# EAGLE schematic main (EAGLE 7.3.0)
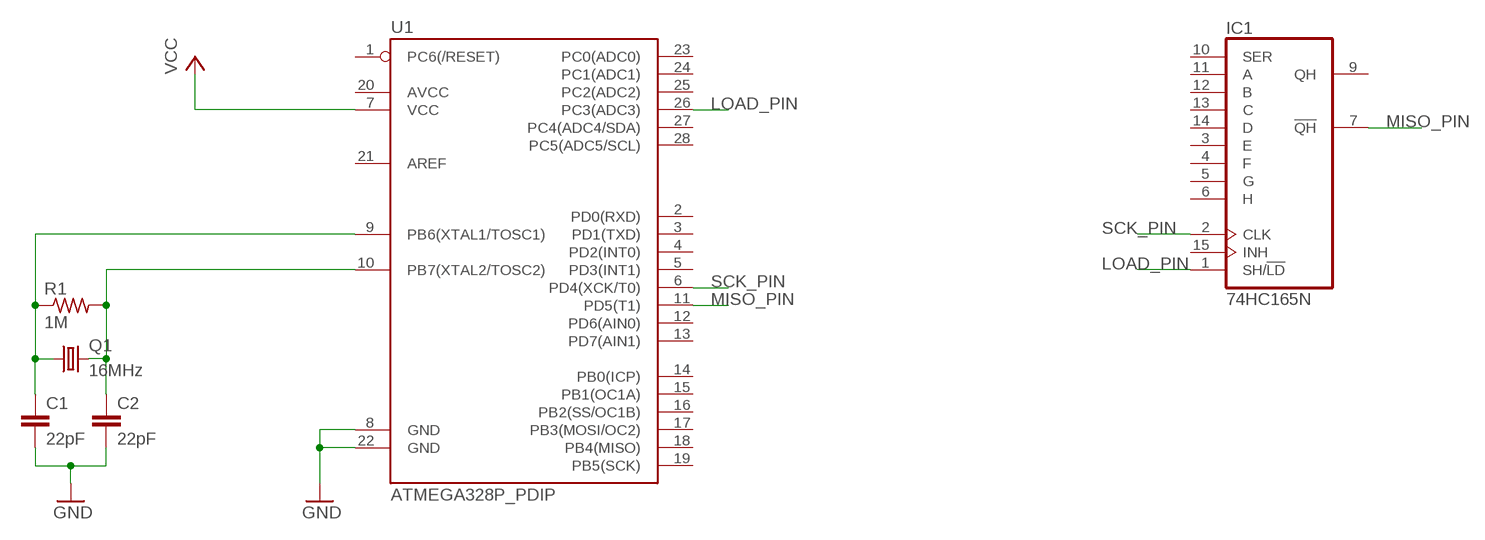
[diagram p0: schematic, sheet 1]

## Parts
C1  22pF  CAPPTH3  [CAP-PTH-LARGE]
C2  22pF  CAPPTH1  [CAP-PTH-5MM]
IC1  74HC165N  [DIL16]
Q1  16MHz  CRYSTALHC33U-V  [HC33U-V]
R1  1M  R-US_0207/10  [0207/10]
U1  ATMEGA328P_PDIP  [DIL28-3]

## Nets
GND: C1.2 C2.2 U1.8(GND) U1.22(GND)
LOAD_PIN: IC1.1(SH/!LD) U1.26(PC3(ADC3))
MISO_PIN: IC1.7(!QH) U1.11(PD5(T1))
N$1: C1.1 Q1.1 R1.1 U1.9(PB6(XTAL1/TOSC1))
N$2: C2.1 Q1.2 R1.2 U1.10(PB7(XTAL2/TOSC2))
SCK_PIN: IC1.2(CLK) U1.6(PD4(XCK/T0))
VCC: U1.7(VCC)
Unconnected: IC1.3(E) IC1.4(F) IC1.5(G) IC1.6(H) IC1.9(QH) IC1.10(SER) IC1.11(A) IC1.12(B) IC1.13(C) IC1.14(D) IC1.15(INH) U1.1(PC6(/RESET)) U1.2(PD0(RXD)) U1.3(PD1(TXD)) U1.4(PD2(INT0)) U1.5(PD3(INT1)) U1.12(PD6(AIN0)) U1.13(PD7(AIN1)) U1.14(PB0(ICP)) U1.15(PB1(OC1A)) U1.16(PB2(SS/OC1B)) U1.17(PB3(MOSI/OC2)) U1.18(PB4(MISO)) U1.19(PB5(SCK)) U1.20(AVCC) U1.21(AREF) U1.23(PC0(ADC0)) U1.24(PC1(ADC1)) U1.25(PC2(ADC2)) U1.27(PC4(ADC4/SDA)) U1.28(PC5(ADC5/SCL))

## Power pins joined to a net without a drawn wire
GND: IC1.8(GND)
VCC: IC1.16(VCC)

## Library data of the parts
C1 C2 = SparkFun-Passives:CAP: Capacitor Standard 0603 ceramic capacitor, and 0.1" leaded capacitor.
IC1 = 74xx-eu:74*165: 8-bit parallel load SHIFT REGISTER
Q1 = crystal:CRYSTAL: CRYSTAL; OC_FARNELL: unknown; OC_NEWARK: unknown
R1 = resistor:R-US_: RESISTOR, American symbol
U1 = SparkFun-DigitalIC:ATMEGA328P_PDIP: uC used in the Arduino 32kb flash, 1k EEPROM, 2k SRAM This is the through-hole version of this chip.